# EAGLE design AVRI2CIO (EAGLE 6.2)
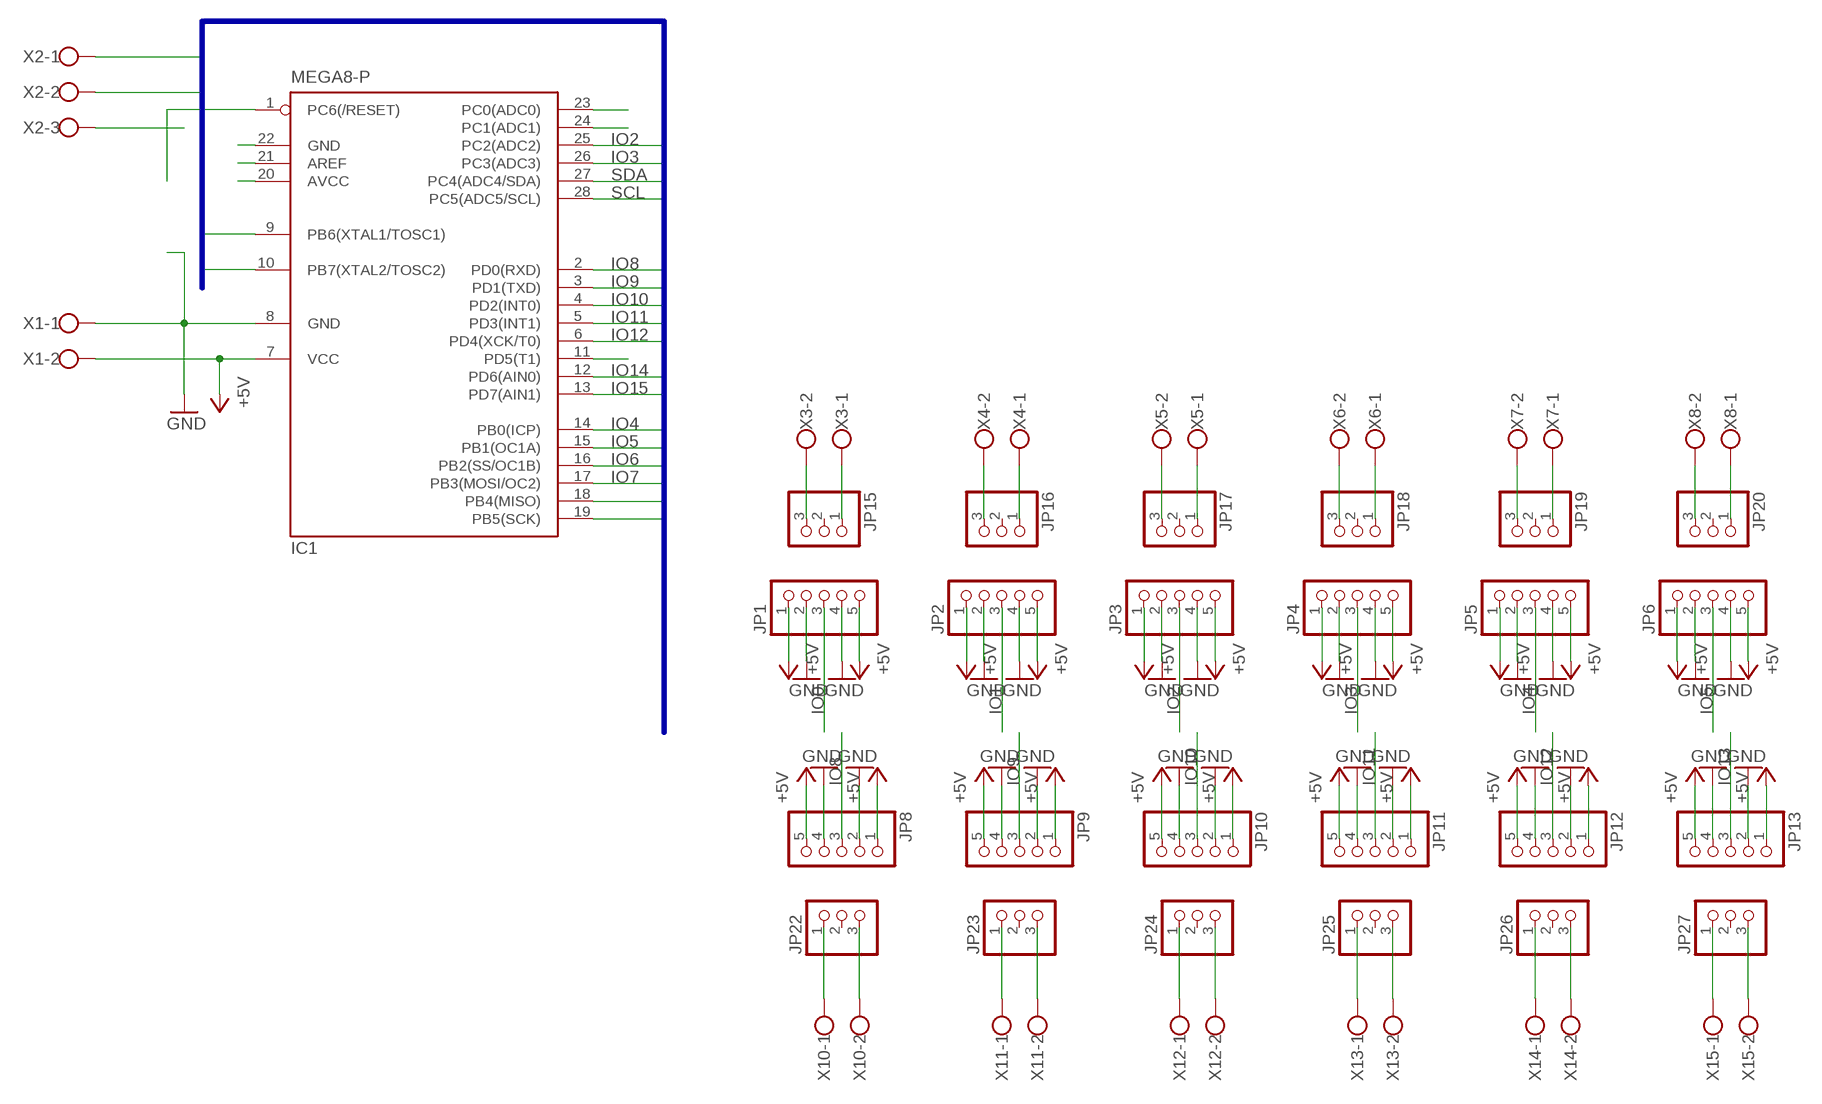
[diagram p0: schematic, sheet 1]

## Parts
IC1  MEGA8-P  [DIL28-3]
JP1  PINHD-1X5  [1X05]
JP2  PINHD-1X5  [1X05]
JP3  PINHD-1X5  [1X05]
JP4  PINHD-1X5  [1X05]
JP5  PINHD-1X5  [1X05]
JP6  PINHD-1X5  [1X05]
JP8  PINHD-1X5  [1X05]
JP9  PINHD-1X5  [1X05]
JP10  PINHD-1X5  [1X05]
JP11  PINHD-1X5  [1X05]
JP12  PINHD-1X5  [1X05]
JP13  PINHD-1X5  [1X05]
JP15  PINHD-1X3  [1X03]
JP16  PINHD-1X3  [1X03]
JP17  PINHD-1X3  [1X03]
JP18  PINHD-1X3  [1X03]
JP19  PINHD-1X3  [1X03]
JP20  PINHD-1X3  [1X03]
JP22  PINHD-1X3  [1X03]
JP23  PINHD-1X3  [1X03]
JP24  PINHD-1X3  [1X03]
JP25  PINHD-1X3  [1X03]
JP26  PINHD-1X3  [1X03]
JP27  PINHD-1X3  [1X03]
X1  W237-102  [W237-102]
X2  W237-103  [W237-103]
X3  W237-102  [W237-102]
X4  W237-102  [W237-102]
X5  W237-102  [W237-102]
X6  W237-102  [W237-102]
X7  W237-102  [W237-102]
X8  W237-102  [W237-102]
X10  W237-102  [W237-102]
X11  W237-102  [W237-102]
X12  W237-102  [W237-102]
X13  W237-102  [W237-102]
X14  W237-102  [W237-102]
X15  W237-102  [W237-102]

## Nets
+5V: IC1.7(VCC) JP1.1 JP1.5 JP2.1 JP2.5 JP3.1 JP3.5 JP4.1 JP4.5 JP5.1 JP5.5 JP6.1 JP6.5 JP8.1 JP8.5 JP9.1 JP9.5 JP10.1 JP10.5 JP11.1 JP11.5 JP12.1 JP12.5 JP13.1 JP13.5 X1.2
GND: IC1.8(GND) JP1.2 JP1.4 JP2.2 JP2.4 JP3.2 JP3.4 JP4.2 JP4.4 JP5.2 JP5.4 JP6.2 JP6.4 JP8.2 JP8.4 JP9.2 JP9.4 JP10.2 JP10.4 JP11.2 JP11.4 JP12.2 JP12.4 JP13.2 JP13.4 X1.1 X2.1
IO0: IC1.11(PD5(T1)) JP1.3
IO1: IC1.9(PB6(XTAL1/TOSC1)) JP2.3
IO2: IC1.25(PC2(ADC2)) JP3.3
IO3: IC1.26(PC3(ADC3)) JP4.3
IO4: IC1.14(PB0(ICP)) JP5.3
IO5: IC1.15(PB1(OC1A)) JP6.3
IO6: IC1.16(PB2(SS/OC1B))
IO7: IC1.17(PB3(MOSI/OC2))
IO8: IC1.2(PD0(RXD)) JP8.3
IO9: IC1.3(PD1(TXD)) JP9.3
IO10: IC1.4(PD2(INT0)) JP10.3
IO11: IC1.5(PD3(INT1)) JP11.3
IO12: IC1.6(PD4(XCK/T0)) JP12.3
IO13: IC1.10(PB7(XTAL2/TOSC2)) JP13.3
IO14: IC1.12(PD6(AIN0))
IO15: IC1.13(PD7(AIN1))
N$1: IC1.24(PC1(ADC1))
N$2: IC1.1(PC6(/RESET))
N$3: JP15.3 X3.2
N$4: JP15.1 X3.1
N$5: JP16.3 X4.2
N$6: JP16.1 X4.1
N$7: JP17.3 X5.2
N$8: JP17.1 X5.1
N$9: JP18.3 X6.2
N$10: JP18.1 X6.1
N$11: JP19.3 X7.2
N$12: JP19.1 X7.1
N$13: JP20.3 X8.2
N$14: JP20.1 X8.1
N$15: IC1.22(GND)
N$16: IC1.21(AREF)
N$17: JP22.1 X10.1
N$18: JP22.3 X10.2
N$19: JP23.1 X11.1
N$20: JP23.3 X11.2
N$21: IC1.18(PB4(MISO))
N$22: IC1.19(PB5(SCK))
N$23: JP24.1 X12.1
N$24: JP24.3 X12.2
N$25: JP25.1 X13.1
N$26: JP25.3 X13.2
N$27: JP26.1 X14.1
N$28: JP26.3 X14.2
N$29: JP27.1 X15.1
N$30: JP27.3 X15.2
N$31: IC1.20(AVCC)
N$32: IC1.23(PC0(ADC0))
SCL: IC1.28(PC5(ADC5/SCL)) X2.2
SDA: IC1.27(PC4(ADC4/SDA)) X2.3
Unconnected: JP15.2 JP16.2 JP17.2 JP18.2 JP19.2 JP20.2 JP22.2 JP23.2 JP24.2 JP25.2 JP26.2 JP27.2

## Buses
PC[0..3]

## Library data of the parts
IC1 = atmel:MEGA8-P: MICROCONTROLLER 8 Kbytes FLASH, 1 kbytes SRAM, 512 bytes EEPROM, USART, 4-channel 10 bit ADC, 2-channel 8 bit ADC Pin compatible with Atmega48, ATMega88, ATMega168 Source: avr.lbr; OC_FARNELL: unknown; OC_NEWARK: unknown
JP1-JP6 JP8-JP13 = pinhead:PINHD-1X5: PIN HEADER
JP15-JP20 JP22-JP27 = pinhead:PINHD-1X3: PIN HEADER
X1 X3-X8 X10-X15 = con-wago-500:W237-102: WAGO SCREW CLAMP; MPN: 237-102; OC_FARNELL: unknown; OC_NEWARK: 70K9898
X2 = con-wago-500:W237-103: WAGO SCREW CLAMP; MPN: 237-103; OC_FARNELL: unknown; OC_NEWARK: 18M7116

## Board
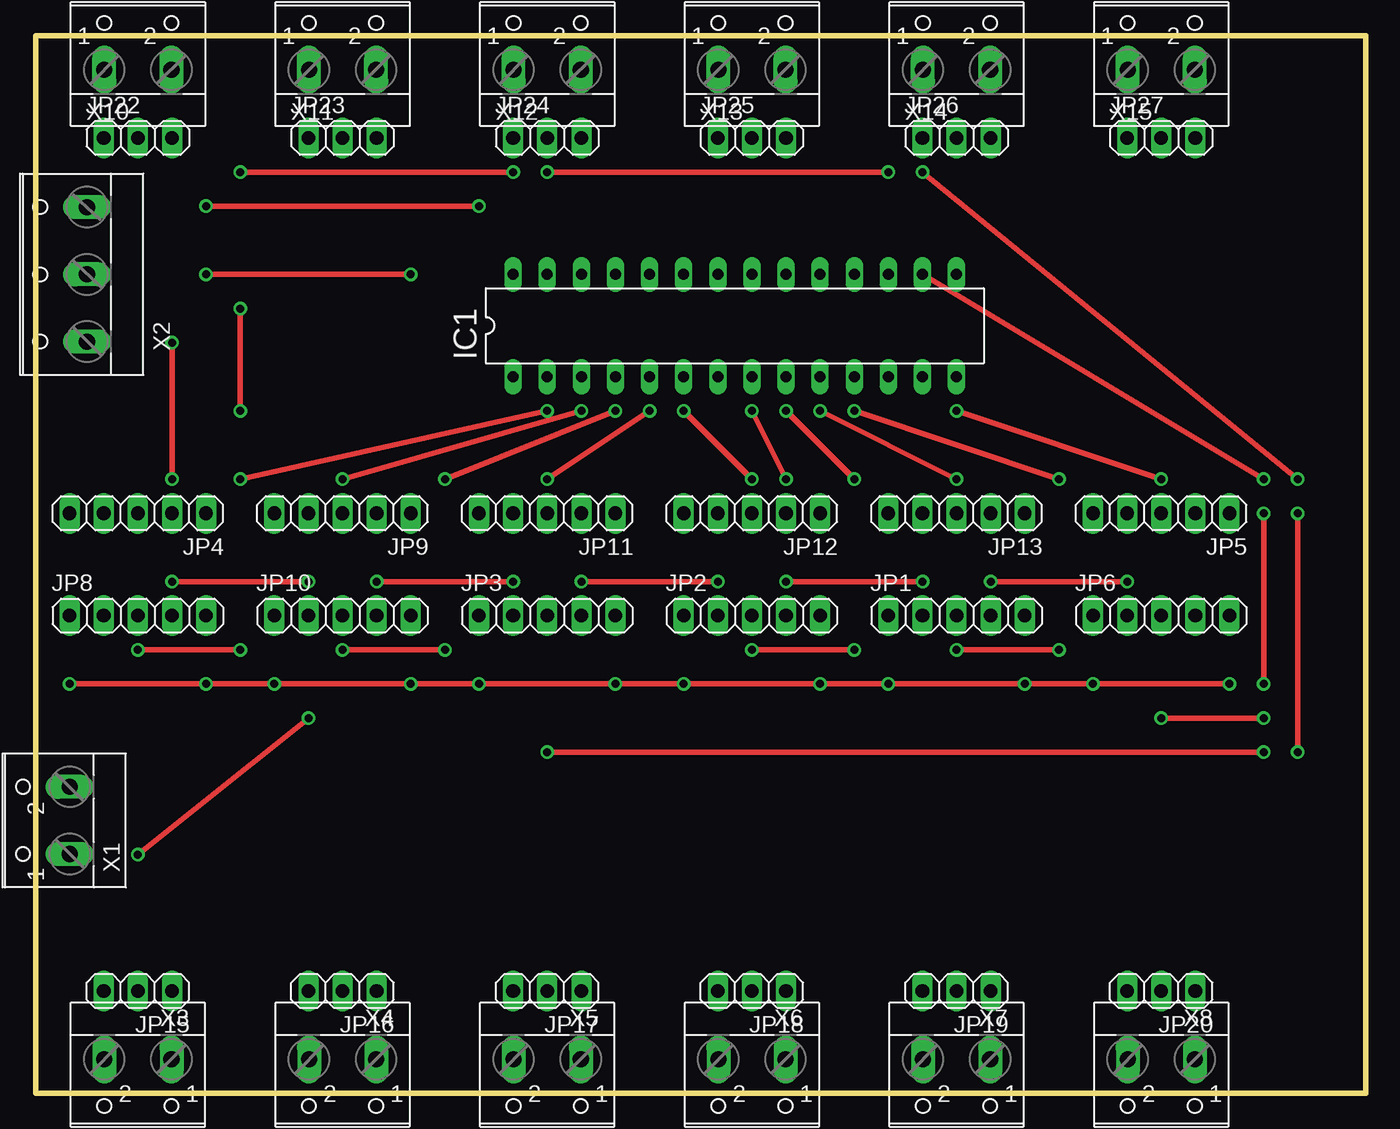
[diagram p1: board, top side]
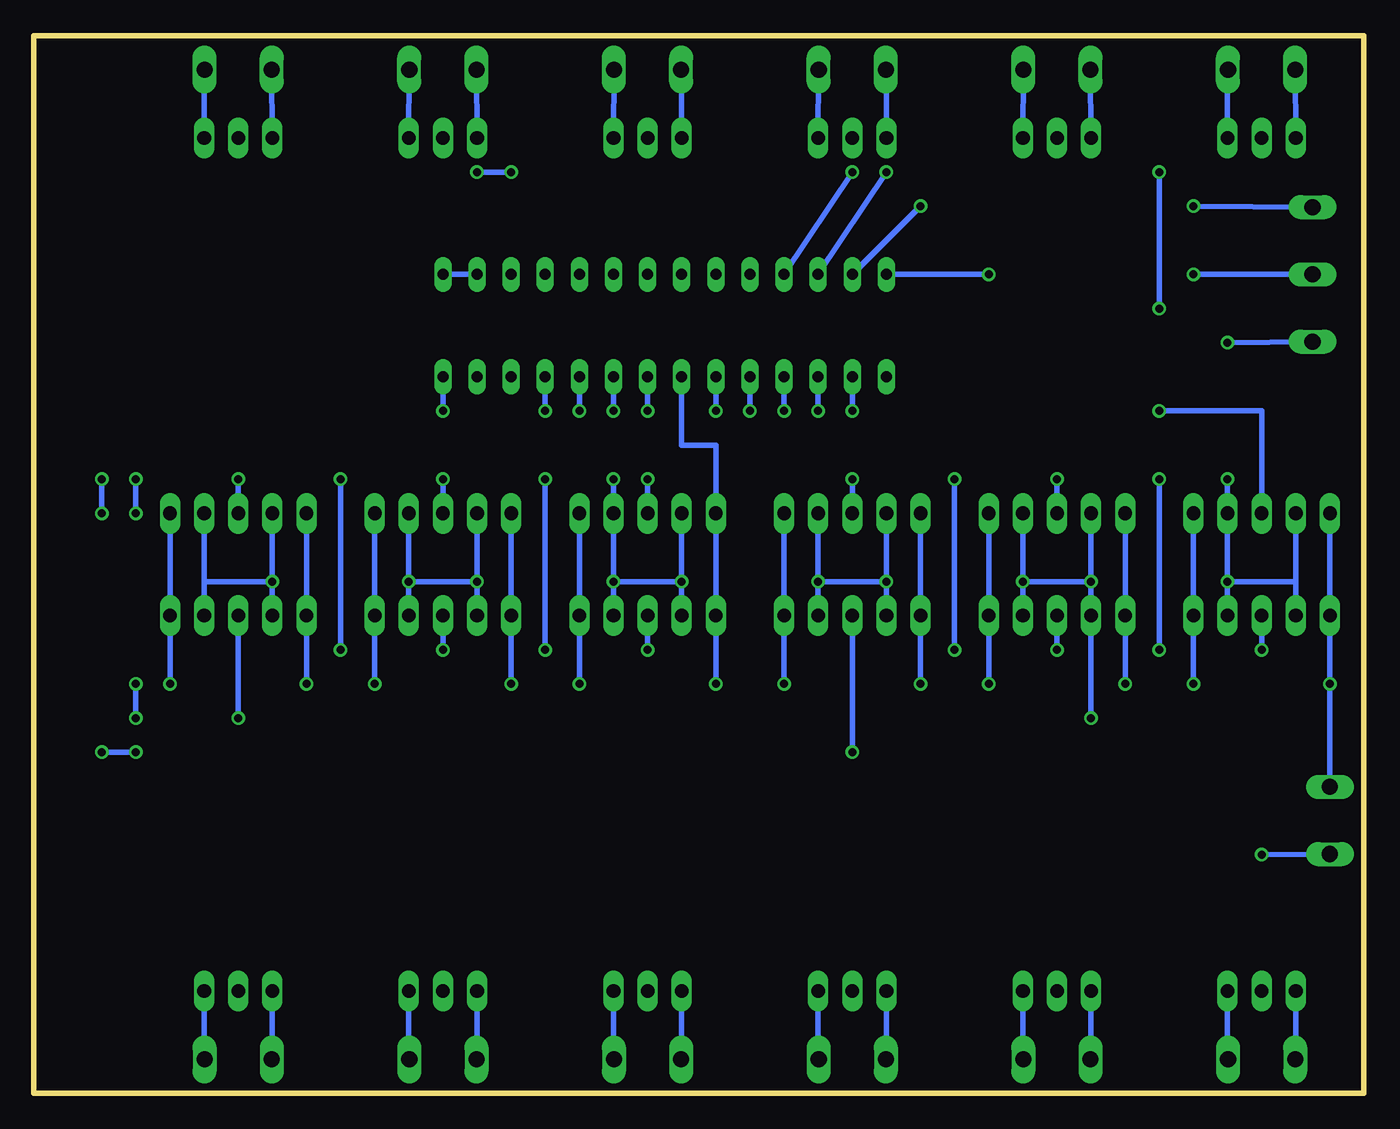
[diagram p2: board, bottom side, seen from below]

Size 99.06 x 78.74 mm. Coordinates in mm from the lower left corner, seen from the top.
Outline: 0,0 99.06,0 99.06,78.74 0,78.74 0,0
Copper layers (1*16): Top 0.035mm / dielectric 1.5mm / Bottom 0.035mm
Design rules: minimum track width 10mil, minimum drill 24mil, track to track 8mil, track to pad 8mil, pad to pad 8mil, via to via 8mil, smd to smd 8mil, copper to edge 40mil, drill to drill 8mil, minimum pad ring 10mil, minimum via ring 8mil, stop-mask expansion 4mil, vias tented up to drill 0mil, thermal gap 10mil

### Footprints (pad centres in the part's own frame; a part is rotated, then mirrored left to right if it is on the bottom)
DIL28-3 = drill 0.813 long: 1 -16.51,-3.81; 2 -13.97,-3.81; 3 -11.43,-3.81; 4 -8.89,-3.81; 5 -6.35,-3.81; 6 -3.81,-3.81; 7 -1.27,-3.81; 8 1.27,-3.81; 9 3.81,-3.81; 10 6.35,-3.81; 11 8.89,-3.81; 12 11.43,-3.81; 13 13.97,-3.81; 14 16.51,-3.81; 15 16.51,3.81; 16 13.97,3.81; 17 11.43,3.81; 18 8.89,3.81; 19 6.35,3.81; 20 3.81,3.81; 21 1.27,3.81; 22 -1.27,3.81; 23 -3.81,3.81; 24 -6.35,3.81; 25 -8.89,3.81; 26 -11.43,3.81; 27 -13.97,3.81; 28 -16.51,3.81
1X05 = drill 1.016 long: 1 -5.08,0; 2 -2.54,0; 3 0,0; 4 2.54,0; 5 5.08,0
1X03 = drill 1.016 long: 1 -2.54,0; 2 0,0; 3 2.54,0
W237-102 = drill 1.194 long: 1 -2.5,-1.27; 2 2.5,-1.27
W237-103 = drill 1.194 long: 1 -5,-1.29; 2 0,-1.29; 3 5,-1.29

### Placement (x,y rotation side)
IC1  52.07,57.15 0 top
JP1  68.58,35.56 0 top
JP2  53.34,35.56 0 top
JP3  38.1,35.56 0 top
JP4  7.62,43.18 180 top
JP5  83.82,43.18 180 top
JP6  83.82,35.56 0 top
JP8  7.62,35.56 0 top
JP9  22.86,43.18 180 top
JP10  22.86,35.56 0 top
JP11  38.1,43.18 180 top
JP12  53.34,43.18 180 top
JP13  68.58,43.18 180 top
JP15  7.62,7.62 180 top
JP16  22.86,7.62 180 top
JP17  38.1,7.62 180 top
JP18  53.34,7.62 180 top
JP19  68.58,7.62 180 top
JP20  83.82,7.62 180 top
JP22  7.62,71.12 0 top
JP23  22.86,71.12 0 top
JP24  38.1,71.12 0 top
JP25  53.34,71.12 0 top
JP26  68.58,71.12 0 top
JP27  83.82,71.12 0 top
X1  1.27,20.32 90 top
X2  2.54,60.96 90 top
X3  7.62,1.27 180 top
X4  22.86,1.27 180 top
X5  38.1,1.27 180 top
X6  53.34,1.27 180 top
X7  68.58,1.27 180 top
X8  83.82,1.27 180 top
X10  7.62,77.47 0 top
X11  22.86,77.47 0 top
X12  38.1,77.47 0 top
X13  53.34,77.47 0 top
X14  68.58,77.47 0 top
X15  83.82,77.47 0 top

### Tracks (layer width: path | path; a pad name or v marks a point on that pad's centre or on a via)
+5V  (via drill 0.6)
  Top 0.406: v2.54,30.48 v12.7,30.48 v17.78,30.48 v27.94,30.48 v33.02,30.48 v43.18,30.48 v48.26,30.48 v58.42,30.48 v63.5,30.48 v73.66,30.48 v78.74,30.48 v88.9,30.48
  Bottom 0.406: JP2.5 58.42,40.64 | JP4.5 JP8.1 v2.54,30.48 X1.2 | JP4.1 JP8.5 v12.7,30.48 | JP12.5 JP2.1 | JP12.5 v48.26,30.48 | JP2.5 JP12.1 v58.42,30.48 JP2.5 | JP1.1 JP13.5 v63.5,30.48 | JP13.1 JP1.5 v73.66,30.48 | JP6.1 JP5.5 v78.74,30.48 | JP5.1 JP6.5 v88.9,30.48 | JP10.1 JP9.5 v17.78,30.48 | JP10.5 JP9.1 v27.94,30.48 | JP12.5 48.26,48.26 50.8,48.26 IC1.7 | JP11.5 JP3.1 v33.02,30.48 JP11.5 | JP11.1 JP3.5 v43.18,30.48 JP11.1
GND  (via drill 0.6)
  Top 0.406: v10.16,45.72 v10.16,55.88 | v10.16,38.1 v20.32,38.1 | v25.4,38.1 v35.56,38.1 | v40.64,38.1 v50.8,38.1 | v55.88,38.1 v66.04,38.1 | v71.12,38.1 v81.28,38.1 | v55.88,45.72 v53.34,50.8 | v7.62,17.78 v20.32,27.94
  Bottom 0.406: X2.1 v10.16,55.88 | v10.16,38.1 JP4.2 v10.16,45.72 | v10.16,38.1 5.08,38.1 | 5.08,38.1 JP8.2 | JP9.2 v25.4,38.1 | v25.4,38.1 v20.32,38.1 | v20.32,38.1 JP10.2 v20.32,27.94 | v55.88,38.1 JP12.2 v55.88,45.72 | v55.88,38.1 v50.8,38.1 | v50.8,38.1 JP2.2 | JP11.2 v40.64,38.1 | v40.64,38.1 v35.56,38.1 | v35.56,38.1 JP3.2 | JP13.2 v71.12,38.1 | v71.12,38.1 v66.04,38.1 | v66.04,38.1 JP1.2 | JP5.2 86.36,38.1 | 86.36,38.1 v81.28,38.1 | v81.28,38.1 JP6.2 | IC1.8 v53.34,50.8 | X1.1 v7.62,17.78 | JP1.4 v71.12,38.1 | JP3.4 v40.64,38.1 | JP10.4 v25.4,38.1 | JP2.4 v55.88,38.1 | JP6.4 86.36,38.1 | JP5.4 v81.28,38.1 | JP12.4 v50.8,38.1 | JP11.4 v35.56,38.1 | JP9.4 v20.32,38.1 | JP4.4 5.08,38.1 | JP8.4 v10.16,38.1 | JP13.4 v66.04,38.1
IO0  (via drill 0.6)
  Top 0.406: v68.58,33.02 v76.2,33.02 | v76.2,45.72 v60.96,50.8
  Bottom 0.406: JP1.3 v68.58,33.02 | v76.2,33.02 v76.2,45.72 | v60.96,50.8 IC1.11
IO1  (via drill 0.6)
  Top 0.406: v53.34,33.02 v60.96,33.02 | v60.96,45.72 v55.88,50.8
  Bottom 0.406: JP2.3 v53.34,33.02 | v60.96,33.02 v60.96,45.72 | v55.88,50.8 IC1.9
IO2  (via drill 0.6)
  Top 0.406: v38.1,68.58 v63.5,68.58 | v66.04,68.58 v93.98,45.72 | v93.98,43.18 v93.98,25.4 | v91.44,25.4 v38.1,25.4
  Bottom 0.406: JP3.3 v38.1,25.4 | IC1.25 v38.1,68.58 | v63.5,68.58 v66.04,68.58 | v93.98,45.72 v93.98,43.18 | v93.98,25.4 v91.44,25.4
IO3  (via drill 0.6)
  Top 0.406: v35.56,68.58 v15.24,68.58 | v15.24,50.8 v15.24,58.42
  Bottom 0.406: JP4.3 7.62,50.8 v15.24,50.8 | IC1.26 v35.56,68.58 | v15.24,58.42 v15.24,68.58
IO4  (via drill 0.6)
  Top 0.406: v83.82,45.72 v68.58,50.8
  Bottom 0.406: IC1.14 v68.58,50.8 | JP5.3 v83.82,45.72
IO5  (via drill 0.6)
  Top 0.406: v83.82,27.94 v91.44,27.94 | v91.44,30.48 v91.44,43.18 | v91.44,45.72 v66.04,60.96
  Bottom 0.406: JP6.3 v83.82,27.94 | v91.44,27.94 v91.44,30.48 | v91.44,43.18 v91.44,45.72 | v66.04,60.96 IC1.15
IO8  (via drill 0.6)
  Top 0.406: v7.62,33.02 v15.24,33.02 | v15.24,45.72 v38.1,50.8
  Bottom 0.406: IC1.2 v38.1,50.8 | JP8.3 v7.62,33.02 | v15.24,33.02 v15.24,45.72
IO9  (via drill 0.6)
  Top 0.406: v22.86,45.72 v40.64,50.8
  Bottom 0.406: IC1.3 v40.64,50.8 | JP9.3 v22.86,45.72
IO10  (via drill 0.6)
  Top 0.406: v22.86,33.02 v30.48,33.02 | v30.48,45.72 v43.18,50.8
  Bottom 0.406: JP10.3 v22.86,33.02 | v30.48,33.02 v30.48,45.72 | IC1.4 v43.18,50.8
IO11  (via drill 0.6)
  Top 0.406: v38.1,45.72 v45.72,50.8
  Bottom 0.406: IC1.5 v45.72,50.8 | JP11.3 v38.1,45.72
IO12  (via drill 0.6)
  Top 0.406: v53.34,45.72 v48.26,50.8
  Bottom 0.406: IC1.6 v48.26,50.8 | JP12.3 v53.34,45.72
IO13  (via drill 0.6)
  Top 0.406: v68.58,45.72 v58.42,50.8
  Bottom 0.406: JP13.3 v68.58,45.72 | v58.42,50.8 IC1.10
N$3
  Bottom 0.406: X3.2 5.08,2.54 JP15.3
N$4
  Bottom 0.406: X3.1 10.16,2.54 JP15.1
N$5
  Bottom 0.406: X4.2 20.32,2.54 JP16.3
N$6
  Bottom 0.406: X4.1 25.4,2.54 JP16.1
N$7
  Bottom 0.406: X5.2 35.56,2.54 JP17.3
N$8
  Bottom 0.406: X5.1 40.64,2.54 JP17.1
N$9
  Bottom 0.406: X6.2 50.8,2.54 JP18.3
N$10
  Bottom 0.406: X6.1 55.88,2.54 JP18.1
N$11
  Bottom 0.406: X7.2 66.04,2.54 JP19.3
N$12
  Bottom 0.406: X7.1 71.12,2.54 JP19.1
N$13
  Bottom 0.406: X8.2 81.28,2.54 JP20.3
N$14
  Bottom 0.406: X8.1 86.36,2.54 JP20.1
N$17
  Bottom 0.406: JP22.1 X10.1
N$18
  Bottom 0.406: JP22.3 10.16,76.2 X10.2
N$19
  Bottom 0.406: JP23.1 X11.1
N$20
  Bottom 0.406: JP23.3 X11.2
N$23
  Bottom 0.406: JP24.1 35.56,76.2 X12.1
N$24
  Bottom 0.406: JP24.3 X12.2
N$25
  Bottom 0.406: JP25.1 50.8,76.2 X13.1
N$26
  Bottom 0.406: JP25.3 X13.2
N$27
  Bottom 0.406: JP26.1 X14.1
N$28
  Bottom 0.406: JP26.3 X14.2
N$29
  Bottom 0.406: JP27.1 X15.1
N$30
  Bottom 0.406: JP27.3 86.36,76.2 X15.2
SCL  (via drill 0.6)
  Top 0.406: v12.7,60.96 v27.94,60.96
  Bottom 0.406: X2.2 v12.7,60.96 | IC1.28 v27.94,60.96
SDA  (via drill 0.6)
  Top 0.406: v12.7,66.04 v33.02,66.04
  Bottom 0.406: X2.3 v12.7,66.04 | IC1.27 v33.02,66.04